# EAGLE design interface2 (EAGLE 7.3.0)
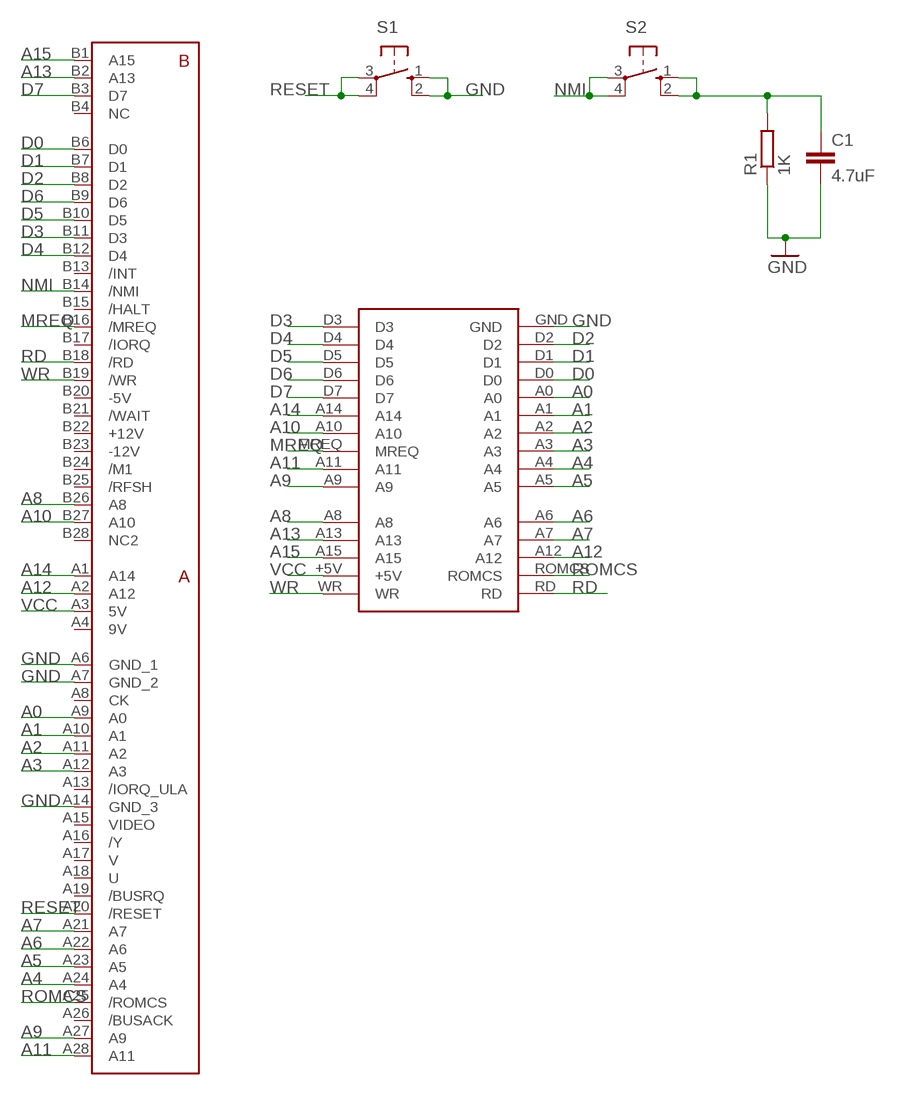
[diagram p0: schematic, sheet 1]

## Parts
C1  4.7uF  C-EU025-025X050  [C025-025X050]
R1  1K  R-EU_0204/5  [0204/5]
S1  10-XX  [B3F-10XX]
S2  10-XX  [B3F-10XX]
U$1  ZX_CARTRIDGE  [ZX_CARTRIDGE]
U$3  ZXSP_ED2X28_SPE  [2X28_SPE]

## Nets
A0: U$1.A0 U$3.A9(A0)
A1: U$1.A1 U$3.A10(A1)
A2: U$1.A2 U$3.A11(A2)
A3: U$1.A3 U$3.A12(A3)
A4: U$1.A4 U$3.A24(A4)
A5: U$1.A5 U$3.A23(A5)
A6: U$1.A6 U$3.A22(A6)
A7: U$1.A7 U$3.A21(A7)
A8: U$1.A8 U$3.B26(A8)
A9: U$1.A9 U$3.A27(A9)
A10: U$1.A10 U$3.B27(A10)
A11: U$1.A11 U$3.A28(A11)
A12: U$1.A12 U$3.A2(A12)
A13: U$1.A13 U$3.B2(A13)
A14: U$1.A14 U$3.A1(A14)
A15: U$1.A15 U$3.B1(A15)
D0: U$1.D0 U$3.B6(D0)
D1: U$1.D1 U$3.B7(D1)
D2: U$1.D2 U$3.B8(D2)
D3: U$1.D3 U$3.B11(D3)
D4: U$1.D4 U$3.B12(D4)
D5: U$1.D5 U$3.B10(D5)
D6: U$1.D6 U$3.B9(D6)
D7: U$1.D7 U$3.B3(D7)
GND: C1.2 R1.1 S1.1(S) S1.2(S1) U$1.GND U$3.A6(GND_1) U$3.A7(GND_2) U$3.A14(GND_3)
MREQ: U$1.MREQ U$3.B16(/MREQ)
N$5: C1.1 R1.2 S2.1(S) S2.2(S1)
NMI: S2.3(P) S2.4(P1) U$3.B14(/NMI)
RD: U$1.RD U$3.B18(/RD)
RESET: S1.3(P) S1.4(P1) U$3.A20(/RESET)
ROMCS: U$1.ROMCS U$3.A25(/ROMCS)
VCC: U$1.+5V U$3.A3(5V)
WR: U$1.WR U$3.B19(/WR)
Unconnected: U$3.A8(CK) U$3.A13(/IORQ_ULA) U$3.A15(VIDEO) U$3.A16(/Y) U$3.A17(V) U$3.A18(U) U$3.A19(/BUSRQ) U$3.A26(/BUSACK) U$3.B4(NC) U$3.B13(/INT) U$3.B15(/HALT) U$3.B17(/IORQ) U$3.B21(/WAIT) U$3.B24(/M1) U$3.B25(/RFSH) U$3.B28(NC2)

## Power pins joined to a net without a drawn wire
9V: U$3.A4(9V)
+12V: U$3.B22(+12V)
-5V: U$3.B20(-5V)
-12V: U$3.B23(-12V)

## Library data of the parts
C1 = resistor:C-EU: CAPACITOR, European symbol
R1 = rcl:R-EU_: RESISTOR, European symbol
S1 S2 = switch-omron:10-XX: OMRON SWITCH; MPN: B3F-1000; OC_FARNELL: 176432; OC_NEWARK: 36M3542
U$1 = 8Bit_Parts:ZX_CARTRIDGE
U$3 = zx_edge:ZXSP_ED

## Board
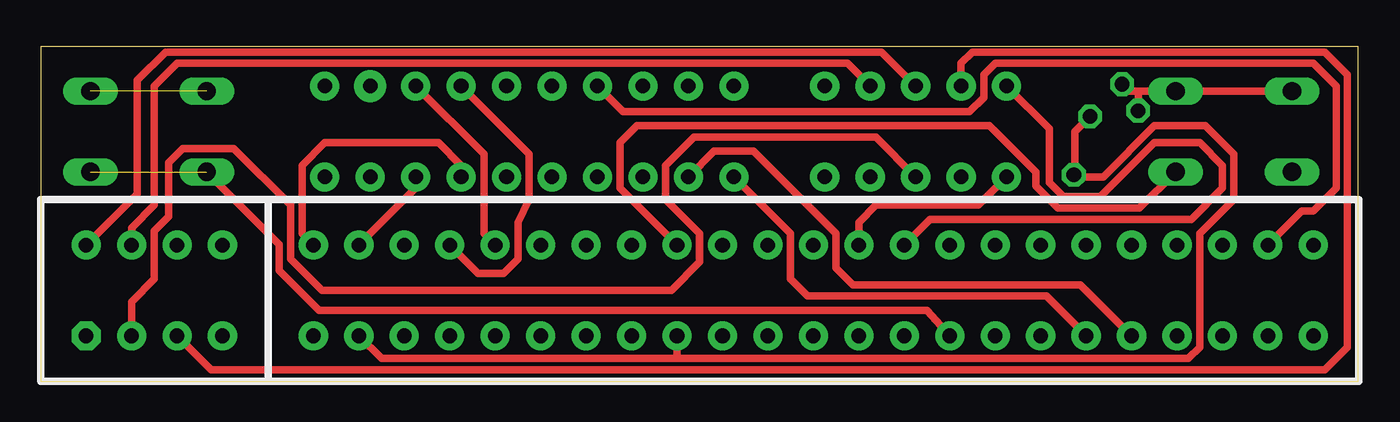
[diagram p1: board, top side]
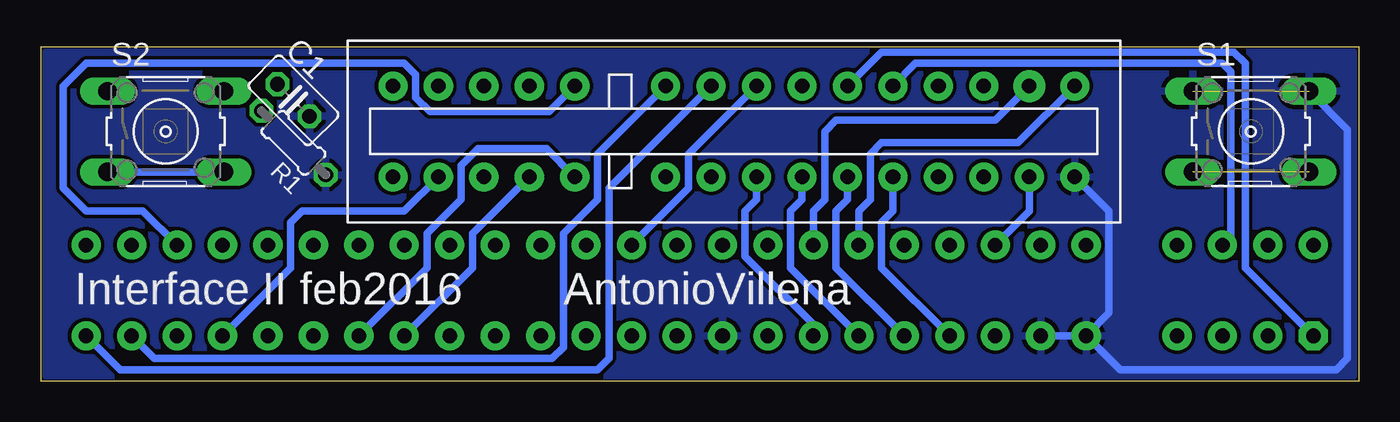
[diagram p2: board, bottom side, seen from below]

No outline drawn. Coordinates in mm, seen from the top.
Copper layers (1*16): Top 0.035mm / dielectric 1.5mm / Bottom 0.035mm
Design rules "default": minimum track width 10mil, minimum drill 24mil, track to track 8mil, track to pad 8mil, pad to pad 8mil, via to via 8mil, smd to smd 8mil, copper to edge 40mil, drill to drill 8mil, minimum pad ring 10mil, minimum via ring 8mil, stop-mask expansion 4mil, vias tented up to drill 0mil, thermal gap 10mil
Milling: 4 lines

### Footprints (pad centres in the part's own frame; a part is rotated, then mirrored left to right if it is on the bottom)
C025-025X050 = drill 0.813 octagon: 1 -1.27,0; 2 1.27,0
0204/5 = drill 0.813 octagon: 1 -2.54,0; 2 2.54,0
B3F-10XX = drill 1.016 long: 1 -3.251,2.261; 2 3.251,2.261; 3 -3.251,-2.261; 4 3.251,-2.261
ZX_CARTRIDGE = drill 0.813 pad 1.626: +5V 17.78,-2.54; A0 -7.62,2.54; A1 -5.08,2.54; A2 -2.54,2.54; A3 0,2.54; A4 2.54,2.54; A5 5.08,2.54; A6 10.16,2.54; A7 12.7,2.54; A8 10.16,-2.54; A9 5.08,-2.54; A10 -2.54,-2.54; A11 2.54,-2.54; A12 15.24,2.54; A13 12.7,-2.54; A14 -5.08,-2.54; A15 15.24,-2.54; D0 -10.16,2.54; D1 -12.7,2.54; D2 -15.24,2.54; D3 -17.78,-2.54; D5 -12.7,-2.54; D6 -10.16,-2.54; D7 -7.62,-2.54; GND -17.78,2.54; MREQ 0,-2.54; RD 20.32,2.54; ROMCS 17.78,2.54; WR 20.32,-2.54 | drill 0.813 pad 1.788: D4 -15.24,-2.54
2X28_SPE = drill 0.813 pad 1.626 octagon: A1 0,-5.08 | drill 0.813 pad 1.626: A2 2.54,-5.08; A3 5.08,-5.08; A4 7.62,-5.08; A6 12.7,-5.08; A7 15.24,-5.08; A8 17.78,-5.08; A9 20.32,-5.08; A10 22.86,-5.08; A11 25.4,-5.08; A12 27.94,-5.08; A13 30.48,-5.08; A14 33.02,-5.08; A15 35.56,-5.08; A16 38.1,-5.08; A17 40.64,-5.08; A18 43.18,-5.08; A19 45.72,-5.08; A20 48.26,-5.08; A21 50.8,-5.08; A22 53.34,-5.08; A23 55.88,-5.08; A24 58.42,-5.08; A25 60.96,-5.08; A26 63.5,-5.08; A27 66.04,-5.08; A28 68.58,-5.08; B1 0,0; B2 2.54,0; B3 5.08,0; B4 7.62,0; B6 12.7,0; B7 15.24,0; B8 17.78,0; B9 20.32,0; B10 22.86,0; B11 25.4,0; B12 27.94,0; B13 30.48,0; B14 33.02,0; B15 35.56,0; B16 38.1,0; B17 40.64,0; B18 43.18,0; B19 45.72,0; B20 48.26,0; B21 50.8,0; B22 53.34,0; B23 55.88,0; B24 58.42,0; B25 60.96,0; B26 63.5,0; B27 66.04,0; B28 68.58,0

### Placement (x,y rotation side)
C1  59.53,15.72 315 bottom
R1  59.53,13.34 135 bottom
S1  6.03,13.97 0 bottom
S2  66.67,13.97 0 bottom
U$1  33.66,13.97 180 bottom
U$3  2.54,7.62 0 top

### Tracks (layer width: path | path; a pad name or v marks a point on that pad's centre or on a via)
A0
  Bottom 0.406: U$3.A9 26.67,6.35 26.67,8.89 26.04,9.53 U$1.A0
A1
  Bottom 0.406: U$3.A10 29.21,6.35 29.21,9.53 28.57,10.16 U$1.A1
A2
  Bottom 0.406: U$3.A11 31.75,6.35 31.75,9.53 31.11,10.16 U$1.A2
A3
  Bottom 0.406: U$1.A3 33.66,10.16 34.29,9.53 34.29,6.99 30.48,3.17 U$3.A12
A4
  Top 0.406: U$1.A4 37.62,12.86 39.85,12.86 44.45,8.26 44.45,6.35 45.4,5.4 58.1,5.4 U$3.A24
A5
  Top 0.406: U$3.A23 56.2,4.76 42.86,4.76 41.91,5.71 41.91,8.26 U$1.A5
A6
  Bottom 0.406: U$1.A6 45.4,13.02 49.21,13.02 50.16,12.06 50.16,10.16 52.07,8.26 52.07,6.35 U$3.A22
A7
  Bottom 0.406: U$1.A7 49.53,8.26 49.53,6.35 U$3.A21
A8
  Bottom 0.406: U$1.A8 45.24,15.08 51.91,15.08 52.7,15.88 52.7,17.14 53.34,17.78 71.12,17.78 72.39,16.51 72.39,10.79 71.12,9.53 67.94,9.53 U$3.B26
A9
  Bottom 0.406: U$1.A9 42.55,12.7 42.55,10.16 44.45,8.26 44.45,1.91 45.09,1.27 67.31,1.27 U$3.A27
A10
  Top 0.406: U$1.A10 32.54,15.08 51.91,15.08 52.7,15.88 52.7,17.14 53.34,17.78 71.12,17.78 72.39,16.51 72.39,10.79 71.12,9.53 70.48,9.53 U$3.B27
A11
  Bottom 0.406: U$1.A11 41.91,10.79 41.91,1.27 42.55,0.64 69.22,0.64 U$3.A28
A12
  Top 0.406: U$1.A12 46.67,13.65 36.51,13.65 34.92,12.06 34.92,10.16 36.83,8.26 36.83,6.67 35.24,5.08 15.72,5.08 13.97,6.83 13.97,9.84 10.79,13.02 7.94,13.02 7.14,12.22 7.14,9.21 6.35,8.41 6.35,5.71 5.08,4.45 U$3.A2
A13
  Top 0.406: U$1.A13 45.09,17.78 7.62,17.78 6.35,16.51 6.35,9.84 5.08,8.57 U$3.B2
A14
  Bottom 0.406: U$1.A14 26.67,18.41 6.99,18.41 6.35,17.78 6.35,6.35 U$3.A1
A15
  Top 0.406: U$1.A15 46.99,18.41 6.99,18.41 5.4,16.83 5.4,10.48 U$3.B1
D0
  Top 0.406: U$1.D0 23.5,12.06 22.23,13.34 15.88,13.34 14.61,12.06 14.61,8.26 U$3.B6
D1
  Top 0.406: U$1.D1 20.95,10.79 U$3.B7
D2
  Bottom 0.406: U$1.D2 18.41,9.53 U$3.B8
D3
  Bottom 0.406: U$1.D3 19.05,13.34 26.67,13.34 27.3,12.7 27.3,10.16 27.94,9.53 U$3.B11
D4
  Bottom 0.406: U$1.D4 20.32,14.61 29.21,14.61 29.84,13.97 29.84,10.16 30.48,9.53 U$3.B12
D5
  Top 0.406: U$1.D5 24.77,12.7 24.77,8.26 U$3.B10
D6
  Top 0.406: U$1.D6 27.3,12.7 27.3,10.16 26.67,8.89 26.67,6.83 25.88,6.03 24.45,6.03 U$3.B9
D7
  Bottom 0.406: U$1.D7 24.77,17.78 7.62,17.78 7.14,17.3 7.14,8.1 U$3.B3
GND  (1 unrouted)
  Top 0.406: 35.72,1.27 19.05,1.27 U$3.A7 | 35.72,1.27 64.14,1.27 64.77,1.91 64.77,8.26 66.67,10.16 66.67,12.7 65.08,14.29 62.23,14.29 59.37,11.43 57.84,11.43 R1.1 57.78,11.59 57.78,13.97 C1.2 | U$3.A14 35.56,1.43 35.72,1.27 | C1.2
  Bottom 0.406: U$3.A6 13.34,0.64 1.27,0.64 0.64,1.27 0.64,14.08 S1.2 | U$3.A6 U$3.A7 | U$1.GND 13.97,9.53 13.97,3.81 U$3.A6
  pour Bottom: 0.32,18.41 73.34,18.41 73.34,0.32 0.32,0.32
MREQ
  Bottom 0.406: U$1.MREQ 37.47,12.7 37.47,10.79 U$3.B16
N$5
  Top 0.406: 61.44,16.23 60.81,16.23 C1.1 | R1.2 61.33,16.12 61.44,16.23 | 61.44,16.23 S2.2 S2.1
NMI
  Top 0.406: U$3.B14 32.38,10.79 32.38,13.34 33.34,14.29 53.02,14.29 55.6,11.71 55.6,10.92 56.83,9.68 61.4,9.68 S2.4
  Bottom 0.406: S2.4 S2.3
RD
  Top 0.406: U$3.B18 45.72,8.89 46.67,9.84 52.39,9.84 U$1.RD
RESET  (1 unrouted)
  Top 0.406: U$3.A20 49.53,3.97 15.56,3.97 13.34,6.19 13.34,7.66 S1.3
ROMCS
  Bottom 0.406: U$3.A25 59.69,6.35 59.69,8.89 59.05,9.53 53.34,9.53 U$1.ROMCS
VCC
  Top 0.406: U$3.A3 9.53,0.64 71.75,0.64 73.03,1.91 73.03,17.14 71.75,18.41 52.07,18.41 51.44,17.78 U$1.+5V
WR
  Top 0.406: U$1.WR 56.36,14.13 56.36,11.11 57.15,10.32 59.21,10.32 62.23,13.34 64.77,13.34 66.04,12.06 66.04,10.79 64.29,9.05 49.69,9.05 U$3.B19

### Text on the board
bPlace: AntonioVillena | Interface II feb2016